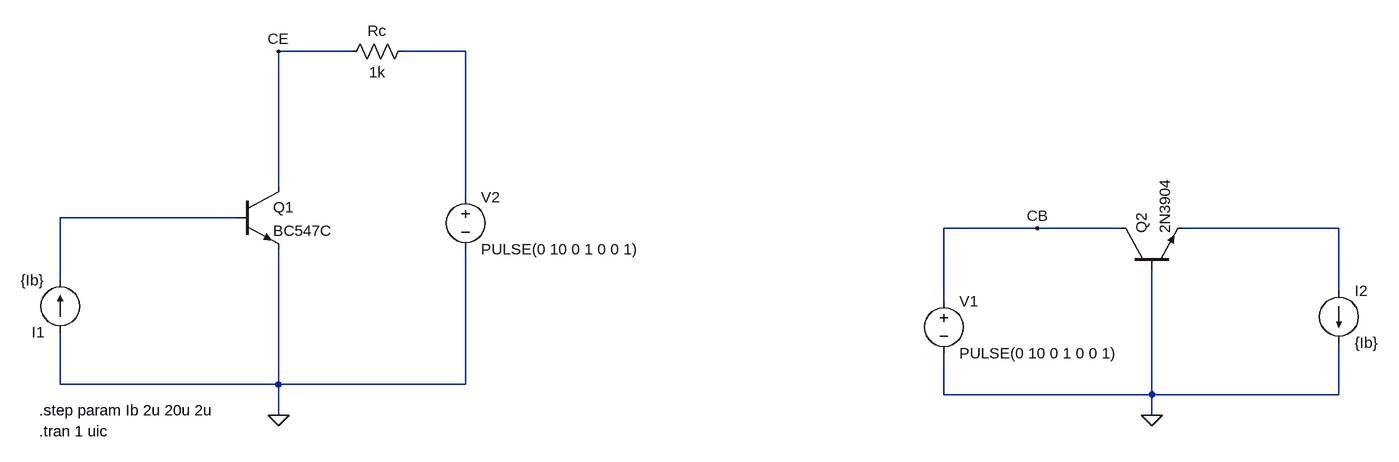
[diagram p0: schematic Curves_Ic_Vce.asc]
Curves_Ic_Vce.asc, the LTspice schematic file:
Version 4
SHEET 1 2144 800
WIRE 272 16 160 16
WIRE 448 16 352 16
WIRE 160 224 160 16
WIRE 448 240 448 16
WIRE 96 272 -176 272
WIRE 1328 288 1184 288
WIRE 1456 288 1328 288
WIRE 1792 288 1552 288
WIRE -176 368 -176 272
WIRE 1792 384 1792 288
WIRE 1184 400 1184 288
WIRE -176 528 -176 448
WIRE 160 528 160 320
WIRE 160 528 -176 528
WIRE 448 528 448 320
WIRE 448 528 160 528
WIRE 1184 544 1184 480
WIRE 1504 544 1504 352
WIRE 1504 544 1184 544
WIRE 1792 544 1792 464
WIRE 1792 544 1504 544
WIRE 160 576 160 528
WIRE 1504 576 1504 544
FLAG 160 576 0
FLAG 160 16 CE
FLAG 1504 576 0
FLAG 1328 288 CB
SYMBOL npn 96 224 R0
SYMATTR InstName Q1
SYMATTR Value BC547C
SYMBOL voltage 448 224 R0
WINDOW 123 0 0 Left 0
WINDOW 39 0 0 Left 0
SYMATTR InstName V2
SYMATTR Value PULSE(0 10 0 1 0 0 1)
SYMBOL res 368 0 R90
WINDOW 0 0 56 VBottom 2
WINDOW 3 32 56 VTop 2
SYMATTR InstName Rc
SYMATTR Value 1k
SYMBOL current -176 448 R180
WINDOW 123 0 0 Left 0
WINDOW 39 0 0 Left 0
SYMATTR InstName I1
SYMATTR Value {Ib}
SYMBOL npn 1456 352 R270
SYMATTR InstName Q2
SYMATTR Value 2N3904
SYMBOL voltage 1184 384 R0
WINDOW 123 0 0 Left 0
WINDOW 39 0 0 Left 0
SYMATTR InstName V1
SYMATTR Value PULSE(0 10 0 1 0 0 1)
SYMBOL current 1792 384 R0
WINDOW 123 0 0 Left 0
WINDOW 39 0 0 Left 0
SYMATTR InstName I2
SYMATTR Value {Ib}
TEXT -208 600 Left 2 !.tran 1 uic
TEXT -208 568 Left 2 !.step param Ib 2u 20u 2u

The netlist it stands for:
* Curves_Ic_Vce.asc
Q1 CE N002 0 0 BC547C
V2 N001 0 PULSE(0 10 0 1 0 0 1)
Rc N001 CE 1k
I1 0 N002 {Ib}
Q2 CB 0 N003 0 2N3904
V1 CB 0 PULSE(0 10 0 1 0 0 1)
I2 N003 0 {Ib}
.model NPN NPN
.model PNP PNP
.lib standard.bjt
.tran 1 uic
.step param Ib 2u 20u 2u
.backanno
.end